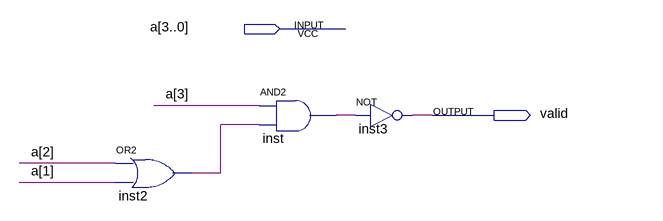
[diagram p0: schematic sheet]
// Quartus schematic isValid.bdf as structural Verilog: 3 symbols, 2 pins
module isValid (
  input  [3:0] a,
  output valid
);

  wire inst2_out, inst_out;

  or inst2 (inst2_out, a[2], a[1]);
  and inst (inst_out, a[3], inst2_out);
  not inst3 (valid, inst_out);
endmodule
